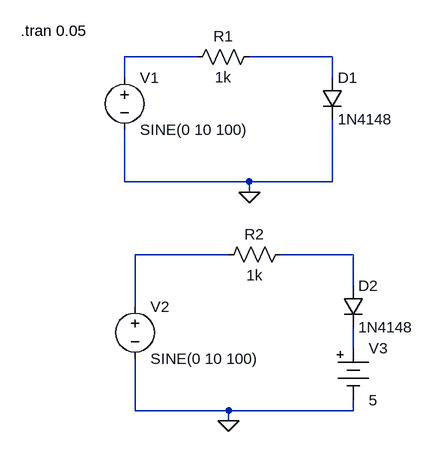
[diagram p0: schematic Ex-5.asc]
Ex-5.asc, the LTspice schematic file:
Version 4
SHEET 1 880 680
WIRE -64 -48 -176 -48
WIRE 144 -48 16 -48
WIRE -176 -16 -176 -48
WIRE 144 -16 144 -48
WIRE -176 144 -176 64
WIRE 16 144 -176 144
WIRE 144 144 144 48
WIRE 144 144 16 144
WIRE 16 160 16 144
WIRE -16 256 -160 256
WIRE 176 256 64 256
WIRE 176 304 176 256
WIRE -160 336 -160 256
WIRE 176 400 176 368
WIRE -160 496 -160 416
WIRE -16 496 -160 496
WIRE 176 496 176 480
WIRE 176 496 -16 496
WIRE -16 512 -16 496
FLAG 16 160 0
FLAG -16 512 0
SYMBOL res 32 -64 R90
WINDOW 0 0 56 VBottom 2
WINDOW 3 32 56 VTop 2
SYMATTR InstName R1
SYMATTR Value 1k
SYMBOL res 80 240 R90
WINDOW 0 0 56 VBottom 2
WINDOW 3 32 56 VTop 2
SYMATTR InstName R2
SYMATTR Value 1k
SYMBOL diode 128 -16 R0
SYMATTR InstName D1
SYMATTR Value 1N4148
SYMBOL diode 160 304 R0
SYMATTR InstName D2
SYMATTR Value 1N4148
SYMBOL voltage -176 -32 R0
WINDOW 123 0 0 Left 0
WINDOW 39 0 0 Left 0
SYMATTR InstName V1
SYMATTR Value SINE(0 10 100)
SYMBOL voltage -160 320 R0
WINDOW 123 0 0 Left 0
WINDOW 39 0 0 Left 0
SYMATTR InstName V2
SYMATTR Value SINE(0 10 100)
SYMBOL Misc\\battery 176 384 R0
WINDOW 123 0 0 Left 0
WINDOW 39 0 0 Left 0
SYMATTR InstName V3
SYMATTR Value 5
TEXT -336 -88 Left 2 !.tran 0.05

The netlist it stands for:
* Ex-5.asc
R1 N002 N001 1k
R2 N004 N003 1k
D1 N002 0 1N4148
D2 N004 N005 1N4148
V1 N001 0 SINE(0 10 100)
V2 N003 0 SINE(0 10 100)
V3 N005 0 5
.model D D
.lib standard.dio
.tran 0.05
.backanno
.end